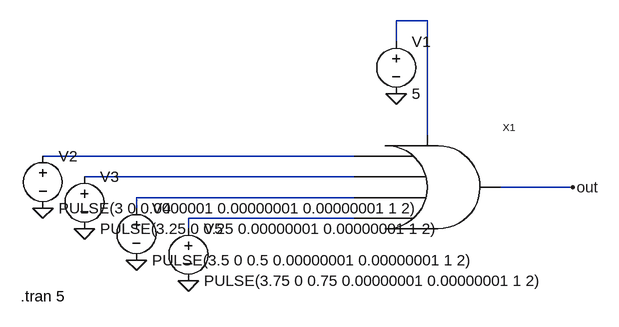
[diagram p0: schematic Draft2.asc]
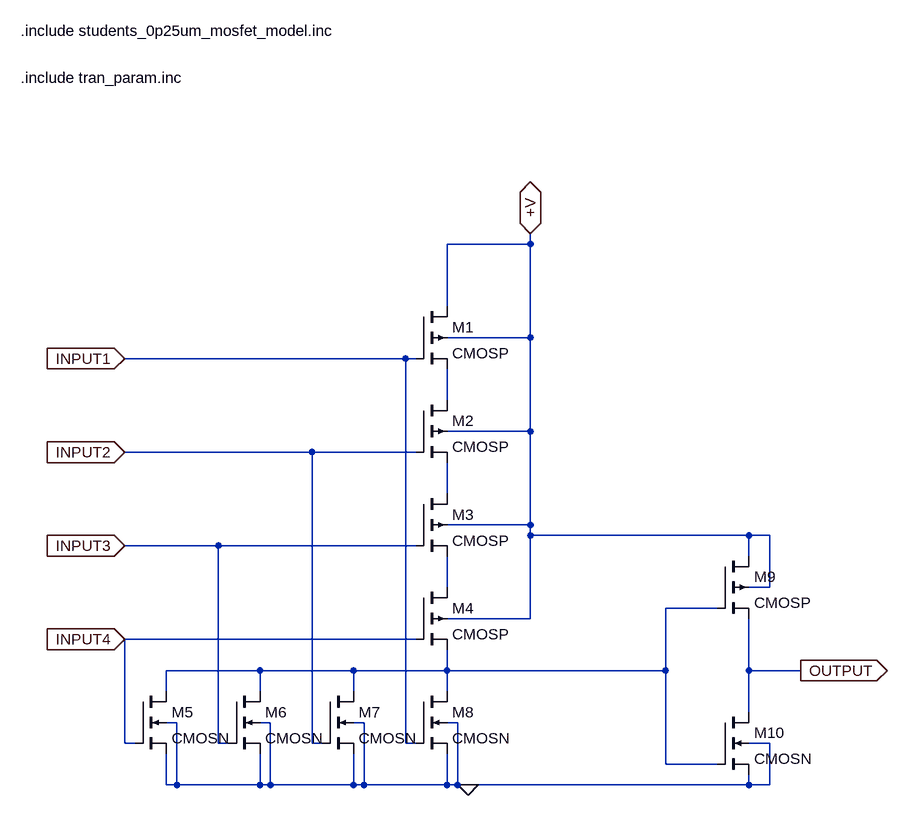
[diagram p1: sub-circuit or4_1.asc]
Draft2.asc, the LTspice schematic file:
Version 4
SHEET 1 880 680
WIRE 272 -96 224 -96
WIRE 224 -64 224 -96
WIRE 272 80 272 -96
WIRE 160 112 -320 112
WIRE 160 144 -256 144
WIRE 496 160 384 160
WIRE 160 176 -176 176
WIRE -176 192 -176 176
WIRE 160 208 -96 208
WIRE -96 224 -96 208
FLAG 224 16 0
FLAG 496 160 out
FLAG -320 192 0
FLAG -256 224 0
FLAG -176 272 0
FLAG -96 304 0
SYMBOL OR4_1 288 160 R0
SYMATTR InstName X1
SYMBOL voltage 224 -80 R0
WINDOW 123 0 0 Left 0
WINDOW 39 0 0 Left 0
SYMATTR InstName V1
SYMATTR Value 5
SYMBOL voltage -320 96 R0
WINDOW 123 0 0 Left 0
WINDOW 39 0 0 Left 0
SYMATTR InstName V2
SYMATTR Value PULSE(3 0 0.0000001 0.00000001 0.00000001 1 2)
SYMBOL voltage -256 128 R0
WINDOW 123 0 0 Left 0
WINDOW 39 0 0 Left 0
SYMATTR InstName V3
SYMATTR Value PULSE(3.25 0 0.25 0.00000001 0.00000001 1 2)
SYMBOL voltage -176 176 R0
WINDOW 123 0 0 Left 0
WINDOW 39 0 0 Left 0
SYMATTR InstName V4
SYMATTR Value PULSE(3.5 0 0.5 0.00000001 0.00000001 1 2)
SYMBOL voltage -96 208 R0
WINDOW 123 0 0 Left 0
WINDOW 39 0 0 Left 0
SYMATTR InstName V5
SYMATTR Value PULSE(3.75 0 0.75 0.00000001 0.00000001 1 2)
TEXT -354 328 Left 2 !.tran 5

or4_1.asc, the sub-circuit schematic file:
Version 4
SHEET 1 2612 2100
WIRE 384 -144 384 -160
WIRE 384 -144 256 -144
WIRE 256 -48 256 -144
WIRE 384 0 384 -144
WIRE 384 0 256 0
WIRE 192 32 -240 32
WIRE 208 32 192 32
WIRE 256 96 256 48
WIRE 384 144 384 0
WIRE 384 144 256 144
WIRE 48 176 -240 176
WIRE 208 176 48 176
WIRE 256 240 256 192
WIRE 384 288 384 144
WIRE 384 288 256 288
WIRE 384 304 384 288
WIRE 720 304 384 304
WIRE 752 304 720 304
WIRE -96 320 -240 320
WIRE 208 320 -96 320
WIRE 720 336 720 304
WIRE 256 384 256 336
WIRE 752 384 752 304
WIRE 752 384 720 384
WIRE 672 416 592 416
WIRE 384 432 384 304
WIRE 384 432 256 432
WIRE 208 464 -240 464
WIRE -32 512 -176 512
WIRE 112 512 -32 512
WIRE 256 512 256 480
WIRE 256 512 112 512
WIRE 592 512 592 416
WIRE 592 512 256 512
WIRE 720 512 720 432
WIRE 800 512 720 512
WIRE -176 544 -176 512
WIRE -32 544 -32 512
WIRE 112 544 112 512
WIRE 256 544 256 512
WIRE 720 576 720 512
WIRE -160 592 -176 592
WIRE -16 592 -32 592
WIRE 128 592 112 592
WIRE 272 592 256 592
WIRE -240 624 -240 464
WIRE -224 624 -240 624
WIRE -96 624 -96 320
WIRE -80 624 -96 624
WIRE 48 624 48 176
WIRE 64 624 48 624
WIRE 192 624 192 32
WIRE 208 624 192 624
WIRE 752 624 720 624
WIRE 592 656 592 512
WIRE 672 656 592 656
WIRE -176 688 -176 640
WIRE -160 688 -160 592
WIRE -160 688 -176 688
WIRE -32 688 -32 640
WIRE -32 688 -160 688
WIRE -16 688 -16 592
WIRE -16 688 -32 688
WIRE 112 688 112 640
WIRE 112 688 -16 688
WIRE 128 688 128 592
WIRE 128 688 112 688
WIRE 256 688 256 640
WIRE 256 688 128 688
WIRE 272 688 272 592
WIRE 272 688 256 688
WIRE 288 688 272 688
WIRE 720 688 720 672
WIRE 720 688 288 688
WIRE 752 688 752 624
WIRE 752 688 720 688
FLAG 288 688 0
FLAG -240 32 INPUT1
IOPIN -240 32 In
FLAG -240 176 INPUT2
IOPIN -240 176 In
FLAG -240 320 INPUT3
IOPIN -240 320 In
FLAG -240 464 INPUT4
IOPIN -240 464 In
FLAG 384 -160 +V
IOPIN 384 -160 BiDir
FLAG 800 512 OUTPUT
IOPIN 800 512 Out
SYMBOL pmos4 208 -48 R0
SYMATTR InstName M1
SYMATTR Value CMOSP
SYMATTR Value2 l={LChan} w={WP} ad={ADP} as={ASP} pd={PDP} ps={PSP}
SYMBOL nmos4 -224 544 R0
SYMATTR InstName M5
SYMATTR Value CMOSN
SYMATTR Value2 l={LChan} w={WN} ad={ADN} as={ASN} pd={PDN} ps={PSN}
SYMBOL pmos4 208 96 R0
SYMATTR InstName M2
SYMATTR Value CMOSP
SYMATTR Value2 l={LChan} w={WP} ad={ADP} as={ASP} pd={PDP} ps={PSP}
SYMBOL pmos4 208 240 R0
SYMATTR InstName M3
SYMATTR Value CMOSP
SYMATTR Value2 l={LChan} w={WP} ad={ADP} as={ASP} pd={PDP} ps={PSP}
SYMBOL pmos4 208 384 R0
SYMATTR InstName M4
SYMATTR Value CMOSP
SYMATTR Value2 l={LChan} w={WP} ad={ADP} as={ASP} pd={PDP} ps={PSP}
SYMBOL pmos4 672 336 R0
SYMATTR InstName M9
SYMATTR Value CMOSP
SYMATTR Value2 l={LChan} w={WP} ad={ADP} as={ASP} pd={PDP} ps={PSP}
SYMBOL nmos4 -80 544 R0
SYMATTR InstName M6
SYMATTR Value CMOSN
SYMATTR Value2 l={LChan} w={WN} ad={ADN} as={ASN} pd={PDN} ps={PSN}
SYMBOL nmos4 64 544 R0
SYMATTR InstName M7
SYMATTR Value CMOSN
SYMATTR Value2 l={LChan} w={WN} ad={ADN} as={ASN} pd={PDN} ps={PSN}
SYMBOL nmos4 208 544 R0
SYMATTR InstName M8
SYMATTR Value CMOSN
SYMATTR Value2 l={LChan} w={WN} ad={ADN} as={ASN} pd={PDN} ps={PSN}
SYMBOL nmos4 672 576 R0
SYMATTR InstName M10
SYMATTR Value CMOSN
SYMATTR Value2 l={LChan} w={WN} ad={ADN} as={ASN} pd={PDN} ps={PSN}
TEXT -400 -472 Left 2 !.include students_0p25um_mosfet_model.inc
TEXT -400 -400 Left 2 !.include tran_param.inc

The netlist it stands for:
* Draft2.asc
XX1 N001 N002 N003 N004 N005 out or4_1
V1 N001 0 5
V2 N002 0 PULSE(3 0 0.0000001 0.00000001 0.00000001 1 2)
V3 N003 0 PULSE(3.25 0 0.25 0.00000001 0.00000001 1 2)
V4 N004 0 PULSE(3.5 0 0.5 0.00000001 0.00000001 1 2)
V5 N005 0 PULSE(3.75 0 0.75 0.00000001 0.00000001 1 2)

* block symbol definitions
.subckt or4_1 +V INPUT1 INPUT2 INPUT3 INPUT4 OUTPUT
M1 +V INPUT1 N001 +V CMOSP l={LChan} w={WP} ad={ADP} as={ASP} pd={PDP} ps={PSP}
M5 N004 INPUT4 0 0 CMOSN l={LChan} w={WN} ad={ADN} as={ASN} pd={PDN} ps={PSN}
M2 N001 INPUT2 N002 +V CMOSP l={LChan} w={WP} ad={ADP} as={ASP} pd={PDP} ps={PSP}
M3 N002 INPUT3 N003 +V CMOSP l={LChan} w={WP} ad={ADP} as={ASP} pd={PDP} ps={PSP}
M4 N003 INPUT4 N004 +V CMOSP l={LChan} w={WP} ad={ADP} as={ASP} pd={PDP} ps={PSP}
M9 +V N004 OUTPUT +V CMOSP l={LChan} w={WP} ad={ADP} as={ASP} pd={PDP} ps={PSP}
M6 N004 INPUT3 0 0 CMOSN l={LChan} w={WN} ad={ADN} as={ASN} pd={PDN} ps={PSN}
M7 N004 INPUT2 0 0 CMOSN l={LChan} w={WN} ad={ADN} as={ASN} pd={PDN} ps={PSN}
M8 N004 INPUT1 0 0 CMOSN l={LChan} w={WN} ad={ADN} as={ASN} pd={PDN} ps={PSN}
M10 OUTPUT N004 0 0 CMOSN l={LChan} w={WN} ad={ADN} as={ASN} pd={PDN} ps={PSN}
.include students_0p25um_mosfet_model.inc
.include tran_param.inc
.ends or4_1

.model NMOS NMOS
.model PMOS PMOS
.lib standard.mos
.tran 5
.backanno
.end